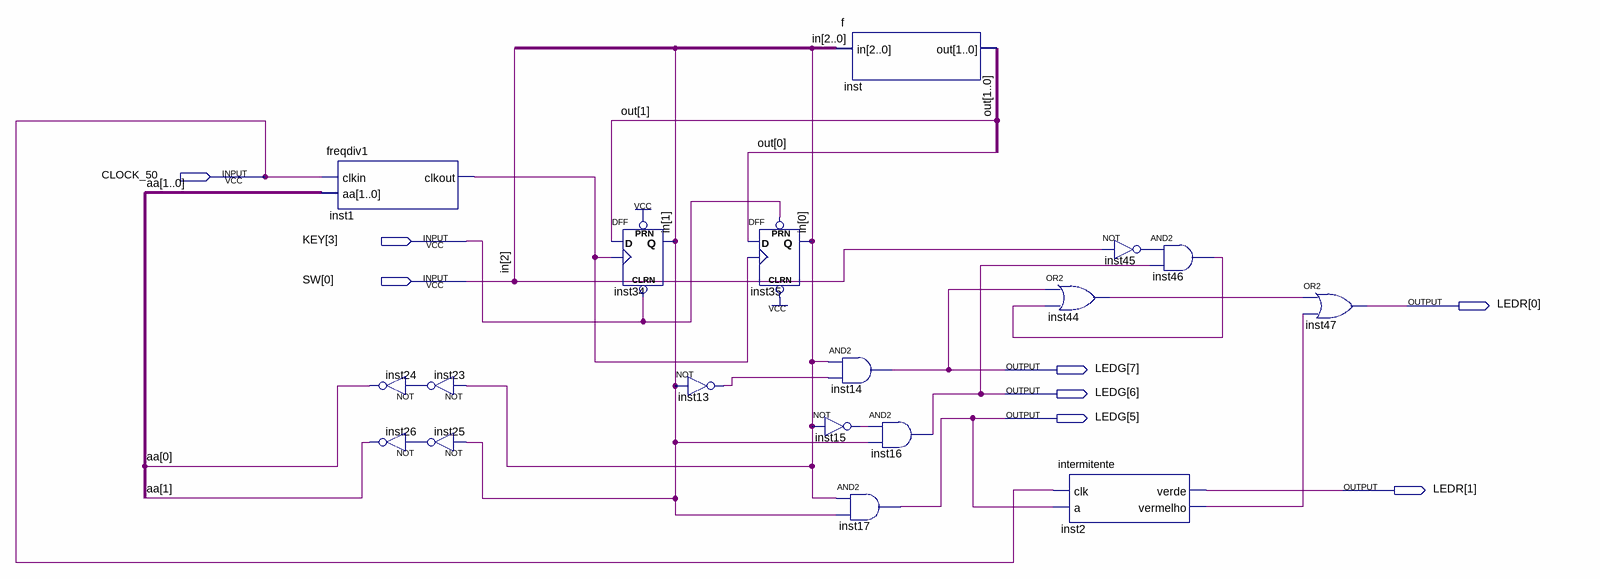
[diagram p0: schematic sheet]
// Quartus schematic exp10.bdf as structural Verilog: 18 symbols, 8 pins
module exp10 (
  input  CLOCK_50,
  input  [3:3] KEY,
  input  [0:0] SW,
  output [1:0] LEDR,
  output [7:5] LEDG
);

  wire inst1_clkout, inst2_vermelho, inst13_out, inst15_out, inst23_out, inst25_out, inst44_out, inst45_out,
       inst46_out;
  wire [1:0] aa, in, out;

  freqdiv1 inst1 (.clkin(CLOCK_50), .aa(aa), .clkout(inst1_clkout));
  not inst24 (aa[0], inst23_out);
  not inst26 (aa[1], inst25_out);
  not inst23 (inst23_out, in[0]);
  not inst25 (inst25_out, in[1]);
  DFF inst34 (.CLRN(KEY[3]), .CLK(inst1_clkout), .D(out[1]), .PRN(1'b1), .Q(in[1]));
  not inst13 (inst13_out, in[1]);
  DFF inst35 (.CLRN(1'b1), .CLK(inst1_clkout), .D(out[0]), .PRN(KEY[3]), .Q(in[0]));
  and inst14 (LEDG[7], in[0], inst13_out);
  not inst15 (inst15_out, in[0]);
  f inst (.in({SW[0], in}), .out(out));
  and inst16 (LEDG[6], inst15_out, in[1]);
  and inst17 (LEDG[5], in[0], in[1]);
  or inst44 (inst44_out, LEDG[7], inst46_out);
  intermitente inst2 (.clk(CLOCK_50), .a(LEDG[5]), .verde(LEDR[1]), .vermelho(inst2_vermelho));
  not inst45 (inst45_out, SW[0]);
  and inst46 (inst46_out, inst45_out, LEDG[6]);
  or inst47 (LEDR[0], inst44_out, inst2_vermelho);

  // Other names for the same wires on the sheet: in[2] = SW[0]
endmodule
